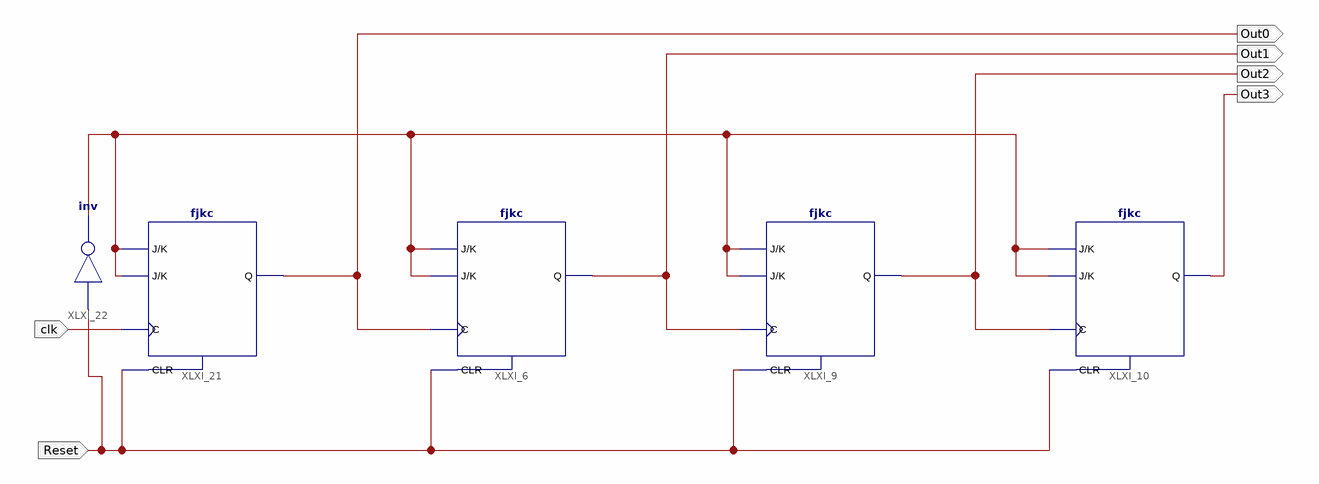
[diagram p0: schematic sheet 1]
// Xilinx ISE schematic broq4.sch (spartan3e) as structural Verilog: 5 symbols, 6 ports
module broq4 (
  input  Reset,
  input  clk,
  output Out3,
  output Out0,
  output Out1,
  output Out2
);

  wire K;

  fjkc XLXI_6 (.C(Out0), .CLR(Reset), .J(K), .K(K), .Q(Out1));
  fjkc XLXI_9 (.C(Out1), .CLR(Reset), .J(K), .K(K), .Q(Out2));
  fjkc XLXI_10 (.C(Out2), .CLR(Reset), .J(K), .K(K), .Q(Out3));
  fjkc XLXI_21 (.C(clk), .CLR(Reset), .J(K), .K(K), .Q(Out0));
  not XLXI_22 (K, Reset);
endmodule
